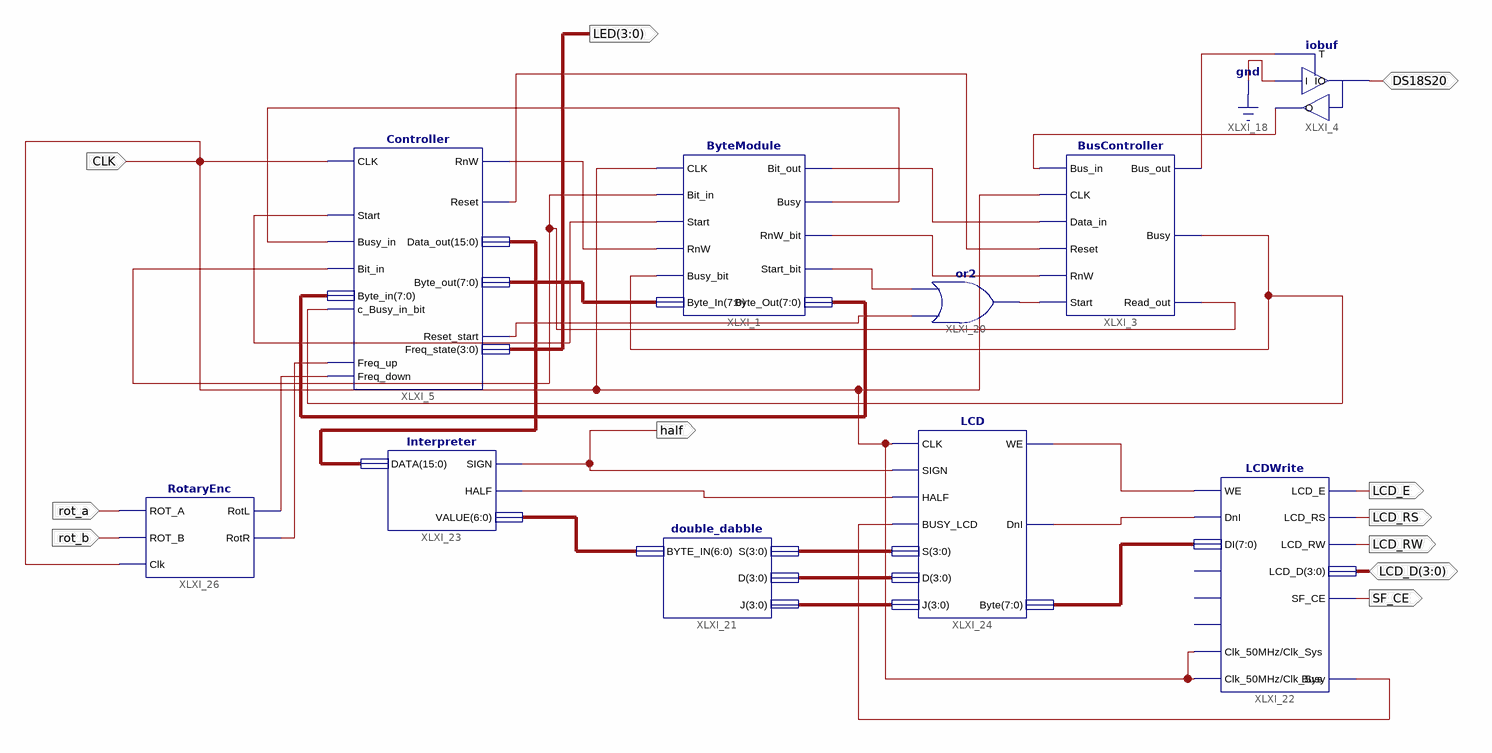
[diagram p0: schematic sheet 1]
// Xilinx ISE schematic Temp_lcd.sch (spartan3e) as structural Verilog: 10 symbols, 11 ports
module Temp_lcd (
  input  CLK,
  input  rot_a,
  input  rot_b,
  inout  DS18S20,
  inout  [3:0] LCD_D,
  output half,
  output LCD_E,
  output LCD_RS,
  output LCD_RW,
  output SF_CE,
  output [3:0] LED
);

  wire XLXN_1, XLXN_2, XLXN_5, XLXN_10, XLXN_12, XLXN_13, XLXN_24, XLXN_142, XLXN_167, XLXN_178, XLXN_179,
       XLXN_180, XLXN_188, XLXN_190, XLXN_191, XLXN_211, XLXN_214, XLXN_216, XLXN_224;
  wire [3:0] XLXN_217, XLXN_218, XLXN_219;
  wire [6:0] XLXN_194;
  wire [7:0] XLXN_19, XLXN_140, XLXN_189;
  wire [15:0] DATA;

  ByteModule XLXI_1 (
    .CLK(CLK), .Bit_in(XLXN_211), .Start(XLXN_12), .RnW(XLXN_10), .Busy_bit(XLXN_167), .Byte_In(XLXN_19),
    .Bit_out(XLXN_1), .Busy(XLXN_13), .RnW_bit(XLXN_2), .Start_bit(XLXN_179), .Byte_Out(XLXN_140));
  BusController XLXI_3 (
    .Bus_in(XLXN_5), .CLK(CLK), .Data_in(XLXN_1), .Reset(XLXN_24), .RnW(XLXN_2), .Start(XLXN_180),
    .Bus_out(XLXN_142), .Busy(XLXN_167), .Read_out(XLXN_211));
  iobuf XLXI_4 (.I(1'b0), .IO(DS18S20), .O(XLXN_5), .T(XLXN_142));
  Controller XLXI_5 (
    .CLK(CLK), .Freq_up(XLXN_214), .Freq_down(XLXN_216), .Busy_in(XLXN_13), .c_Busy_in_bit(XLXN_167),
    .Bit_in(XLXN_211), .Byte_in(XLXN_140), .Start(XLXN_12), .RnW(XLXN_10), .Reset(XLXN_24),
    .Reset_start(XLXN_178), .Data_out(DATA), .Byte_out(XLXN_19), .Freq_state(LED));
  or XLXI_20 (XLXN_180, XLXN_178, XLXN_179);
  double_dabble XLXI_21 (.BYTE_IN(XLXN_194), .D(XLXN_218), .S(XLXN_217), .J(XLXN_219));
  LCDWrite XLXI_22 (
    .WE(XLXN_191), .DnI(XLXN_190), .DI(XLXN_189), .LCD_E(LCD_E), .LCD_RS(LCD_RS), .LCD_RW(LCD_RW),
    .LCD_D(LCD_D), .SF_CE(SF_CE), .Busy(XLXN_188), .Clk_50MHz(CLK), .Clk_Sys(CLK));  // open: Reset, Cursor, Blink
  Interpreter XLXI_23 (.DATA(DATA), .VALUE(XLXN_194), .HALF(XLXN_224), .SIGN(half));
  LCD XLXI_24 (
    .CLK(CLK), .SIGN(half), .HALF(XLXN_224), .BUSY_LCD(XLXN_188), .S(XLXN_217), .D(XLXN_218), .J(XLXN_219),
    .WE(XLXN_191), .DnI(XLXN_190), .Byte(XLXN_189));
  RotaryEnc XLXI_26 (.ROT_A(rot_a), .ROT_B(rot_b), .RotL(XLXN_216), .RotR(XLXN_214), .Clk(CLK));
endmodule
